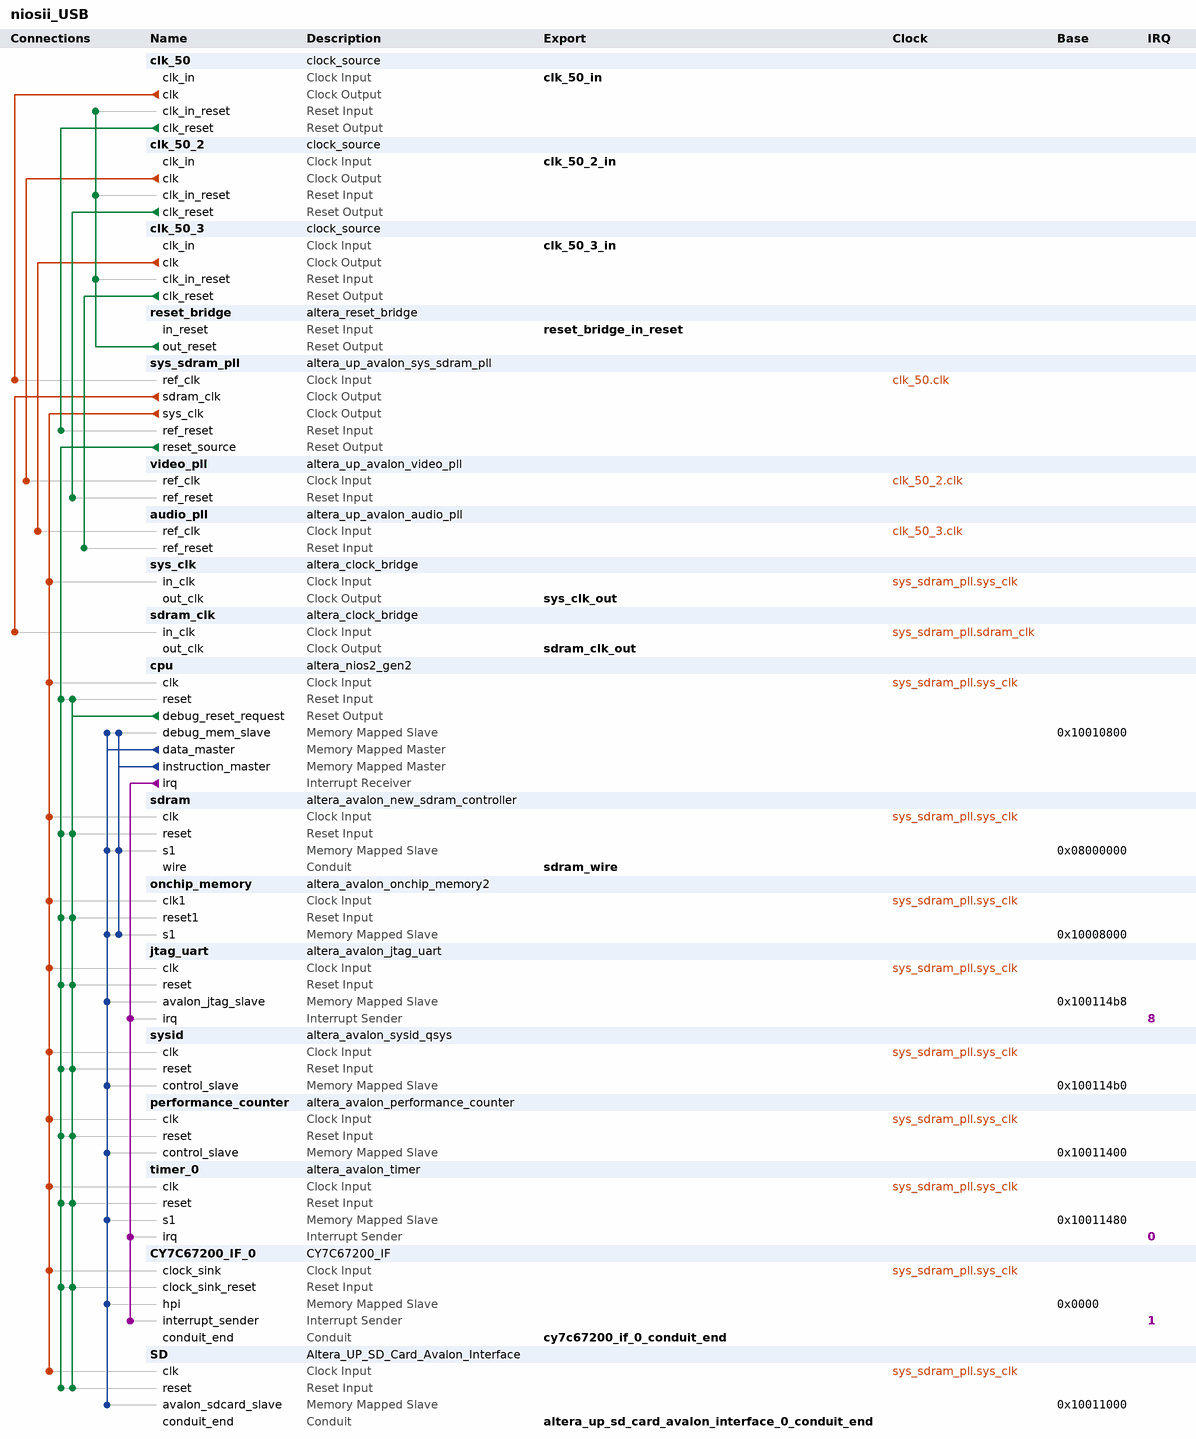
[diagram p0: system contents]
# Platform Designer (Qsys) system niosii_USB, Cyclone IV E EP4CE115F29C7
# Parameters at their usual value, and those the tool derives, are not listed.
package require -exact qsys 17.1
create_system niosii_USB
set_project_property DEVICE_FAMILY {Cyclone IV E}
set_project_property DEVICE EP4CE115F29C7

add_instance clk_50 clock_source 17.1
set_instance_parameter_value clk_50 clockFrequency 50000000

add_instance clk_50_2 clock_source 17.1
set_instance_parameter_value clk_50_2 clockFrequency 50000000

add_instance clk_50_3 clock_source 17.1
set_instance_parameter_value clk_50_3 clockFrequency 50000000

add_instance reset_bridge altera_reset_bridge 17.1
set_instance_parameter_value reset_bridge ACTIVE_LOW_RESET 1
set_instance_parameter_value reset_bridge SYNCHRONOUS_EDGES none

add_instance sys_sdram_pll altera_up_avalon_sys_sdram_pll 17.1
set_instance_parameter_value sys_sdram_pll CV_boards DE10-Standard
set_instance_parameter_value sys_sdram_pll gui_outclk 50.0
set_instance_parameter_value sys_sdram_pll gui_refclk 50.0

add_instance video_pll altera_up_avalon_video_pll 17.1
set_instance_parameter_value video_pll camera {5MP Digital Camera (THDB_D5M)}
set_instance_parameter_value video_pll gui_refclk 50.0
set_instance_parameter_value video_pll lcd {7" LCD on VEEK-MT and MTL/MTL2 Modules}
set_instance_parameter_value video_pll lcd_clk_en true

add_instance audio_pll altera_up_avalon_audio_pll 17.1
set_instance_parameter_value audio_pll gui_refclk 50.0

add_instance sys_clk altera_clock_bridge 17.1
set_instance_parameter_value sys_clk DERIVED_CLOCK_RATE 50000000
set_instance_parameter_value sys_clk EXPLICIT_CLOCK_RATE 0

add_instance sdram_clk altera_clock_bridge 17.1
set_instance_parameter_value sdram_clk DERIVED_CLOCK_RATE 50000000
set_instance_parameter_value sdram_clk EXPLICIT_CLOCK_RATE 0

add_instance cpu altera_nios2_gen2 17.1
set_instance_parameter_value cpu dcache_size 2048
set_instance_parameter_value cpu debug_datatrigger 2
set_instance_parameter_value cpu debug_hwbreakpoint 2
set_instance_parameter_value cpu exceptionSlave sdram.s1
set_instance_parameter_value cpu icache_size 4096
set_instance_parameter_value cpu impl Fast
set_instance_parameter_value cpu io_regionbase 268435456
set_instance_parameter_value cpu io_regionsize 16384
set_instance_parameter_value cpu resetSlave sdram.s1

add_instance sdram altera_avalon_new_sdram_controller 17.1
set_instance_parameter_value sdram TAC 5.5
set_instance_parameter_value sdram TRCD 20.0
set_instance_parameter_value sdram TRP 20.0
set_instance_parameter_value sdram casLatency 3
set_instance_parameter_value sdram columnWidth 10
set_instance_parameter_value sdram dataWidth 32
set_instance_parameter_value sdram generateSimulationModel true
set_instance_parameter_value sdram model single_Micron_MT48LC4M32B2_7_chip
set_instance_parameter_value sdram numberOfBanks 4
set_instance_parameter_value sdram numberOfChipSelects 1
set_instance_parameter_value sdram powerUpDelay 100.0
set_instance_parameter_value sdram refreshPeriod 15.625
set_instance_parameter_value sdram rowWidth 13

add_instance onchip_memory altera_avalon_onchip_memory2 17.1
set_instance_parameter_value onchip_memory dataWidth 32
set_instance_parameter_value onchip_memory dualPort false
set_instance_parameter_value onchip_memory initMemContent true
set_instance_parameter_value onchip_memory initializationFileName onchip_mem.hex
set_instance_parameter_value onchip_memory memorySize 32768

add_instance jtag_uart altera_avalon_jtag_uart 17.1
set_instance_parameter_value jtag_uart simInteractiveOptions NO_INTERACTIVE_WINDOWS

add_instance sysid altera_avalon_sysid_qsys 17.1
set_instance_parameter_value sysid id 0

add_instance performance_counter altera_avalon_performance_counter 17.1
set_instance_parameter_value performance_counter numberOfSections 7

add_instance timer_0 altera_avalon_timer 17.1
set_instance_parameter_value timer_0 period 1
set_instance_parameter_value timer_0 periodUnits MSEC

add_instance CY7C67200_IF_0 CY7C67200_IF 1.0

add_instance SD Altera_UP_SD_Card_Avalon_Interface 17.1

# connections
add_connection clk_50.clk sys_sdram_pll.ref_clk clock
add_connection clk_50_2.clk video_pll.ref_clk clock
add_connection clk_50_3.clk audio_pll.ref_clk clock
add_connection sys_sdram_pll.sdram_clk sdram_clk.in_clk clock
add_connection sys_sdram_pll.sys_clk cpu.clk clock
add_connection sys_sdram_pll.sys_clk CY7C67200_IF_0.clock_sink clock
add_connection sys_sdram_pll.sys_clk jtag_uart.clk clock
add_connection sys_sdram_pll.sys_clk onchip_memory.clk1 clock
add_connection sys_sdram_pll.sys_clk performance_counter.clk clock
add_connection sys_sdram_pll.sys_clk SD.clk clock
add_connection sys_sdram_pll.sys_clk sdram.clk clock
add_connection sys_sdram_pll.sys_clk sys_clk.in_clk clock
add_connection sys_sdram_pll.sys_clk sysid.clk clock
add_connection sys_sdram_pll.sys_clk timer_0.clk clock
add_connection clk_50.clk_reset sys_sdram_pll.ref_reset reset
add_connection clk_50_2.clk_reset video_pll.ref_reset reset
add_connection clk_50_3.clk_reset audio_pll.ref_reset reset
add_connection cpu.debug_reset_request cpu.reset reset
add_connection cpu.debug_reset_request CY7C67200_IF_0.clock_sink_reset reset
add_connection cpu.debug_reset_request jtag_uart.reset reset
add_connection cpu.debug_reset_request onchip_memory.reset1 reset
add_connection cpu.debug_reset_request performance_counter.reset reset
add_connection cpu.debug_reset_request SD.reset reset
add_connection cpu.debug_reset_request sdram.reset reset
add_connection cpu.debug_reset_request sysid.reset reset
add_connection cpu.debug_reset_request timer_0.reset reset
add_connection reset_bridge.out_reset clk_50.clk_in_reset reset
add_connection reset_bridge.out_reset clk_50_2.clk_in_reset reset
add_connection reset_bridge.out_reset clk_50_3.clk_in_reset reset
add_connection sys_sdram_pll.reset_source cpu.reset reset
add_connection sys_sdram_pll.reset_source CY7C67200_IF_0.clock_sink_reset reset
add_connection sys_sdram_pll.reset_source jtag_uart.reset reset
add_connection sys_sdram_pll.reset_source onchip_memory.reset1 reset
add_connection sys_sdram_pll.reset_source performance_counter.reset reset
add_connection sys_sdram_pll.reset_source SD.reset reset
add_connection sys_sdram_pll.reset_source sdram.reset reset
add_connection sys_sdram_pll.reset_source sysid.reset reset
add_connection sys_sdram_pll.reset_source timer_0.reset reset
add_connection cpu.data_master cpu.debug_mem_slave avalon
set_connection_parameter_value cpu.data_master/cpu.debug_mem_slave baseAddress 0x10010800
add_connection cpu.data_master CY7C67200_IF_0.hpi avalon
set_connection_parameter_value cpu.data_master/CY7C67200_IF_0.hpi baseAddress 0x0000
add_connection cpu.data_master jtag_uart.avalon_jtag_slave avalon
set_connection_parameter_value cpu.data_master/jtag_uart.avalon_jtag_slave baseAddress 0x100114b8
add_connection cpu.data_master onchip_memory.s1 avalon
set_connection_parameter_value cpu.data_master/onchip_memory.s1 baseAddress 0x10008000
add_connection cpu.data_master performance_counter.control_slave avalon
set_connection_parameter_value cpu.data_master/performance_counter.control_slave baseAddress 0x10011400
add_connection cpu.data_master SD.avalon_sdcard_slave avalon
set_connection_parameter_value cpu.data_master/SD.avalon_sdcard_slave baseAddress 0x10011000
add_connection cpu.data_master sdram.s1 avalon
set_connection_parameter_value cpu.data_master/sdram.s1 baseAddress 0x08000000
add_connection cpu.data_master sysid.control_slave avalon
set_connection_parameter_value cpu.data_master/sysid.control_slave baseAddress 0x100114b0
add_connection cpu.data_master timer_0.s1 avalon
set_connection_parameter_value cpu.data_master/timer_0.s1 baseAddress 0x10011480
add_connection cpu.instruction_master cpu.debug_mem_slave avalon
set_connection_parameter_value cpu.instruction_master/cpu.debug_mem_slave baseAddress 0x10010800
add_connection cpu.instruction_master onchip_memory.s1 avalon
set_connection_parameter_value cpu.instruction_master/onchip_memory.s1 baseAddress 0x10008000
add_connection cpu.instruction_master sdram.s1 avalon
set_connection_parameter_value cpu.instruction_master/sdram.s1 baseAddress 0x08000000
add_connection cpu.irq CY7C67200_IF_0.interrupt_sender interrupt
set_connection_parameter_value cpu.irq/CY7C67200_IF_0.interrupt_sender irqNumber 1
add_connection cpu.irq jtag_uart.irq interrupt
set_connection_parameter_value cpu.irq/jtag_uart.irq irqNumber 8
add_connection cpu.irq timer_0.irq interrupt
set_connection_parameter_value cpu.irq/timer_0.irq irqNumber 0

# exported interfaces
add_interface altera_up_sd_card_avalon_interface_0_conduit_end conduit end
set_interface_property altera_up_sd_card_avalon_interface_0_conduit_end EXPORT_OF SD.conduit_end
add_interface clk_50_2_in clock sink
set_interface_property clk_50_2_in EXPORT_OF clk_50_2.clk_in
add_interface clk_50_3_in clock sink
set_interface_property clk_50_3_in EXPORT_OF clk_50_3.clk_in
add_interface clk_50_in clock sink
set_interface_property clk_50_in EXPORT_OF clk_50.clk_in
add_interface cy7c67200_if_0_conduit_end conduit end
set_interface_property cy7c67200_if_0_conduit_end EXPORT_OF CY7C67200_IF_0.conduit_end
add_interface reset_bridge_in_reset reset sink
set_interface_property reset_bridge_in_reset EXPORT_OF reset_bridge.in_reset
add_interface sdram_clk_out clock source
set_interface_property sdram_clk_out EXPORT_OF sdram_clk.out_clk
add_interface sdram_wire conduit end
set_interface_property sdram_wire EXPORT_OF sdram.wire
add_interface sys_clk_out clock source
set_interface_property sys_clk_out EXPORT_OF sys_clk.out_clk

set_interconnect_requirement {$system} qsys_mm.clockCrossingAdapter HANDSHAKE
set_interconnect_requirement {$system} qsys_mm.enableEccProtection FALSE
set_interconnect_requirement {$system} qsys_mm.insertDefaultSlave FALSE
set_interconnect_requirement {$system} qsys_mm.maxAdditionalLatency 1

save_system niosii_USB.qsys
